# EAGLE design MainPower (EAGLE 9.6.2)
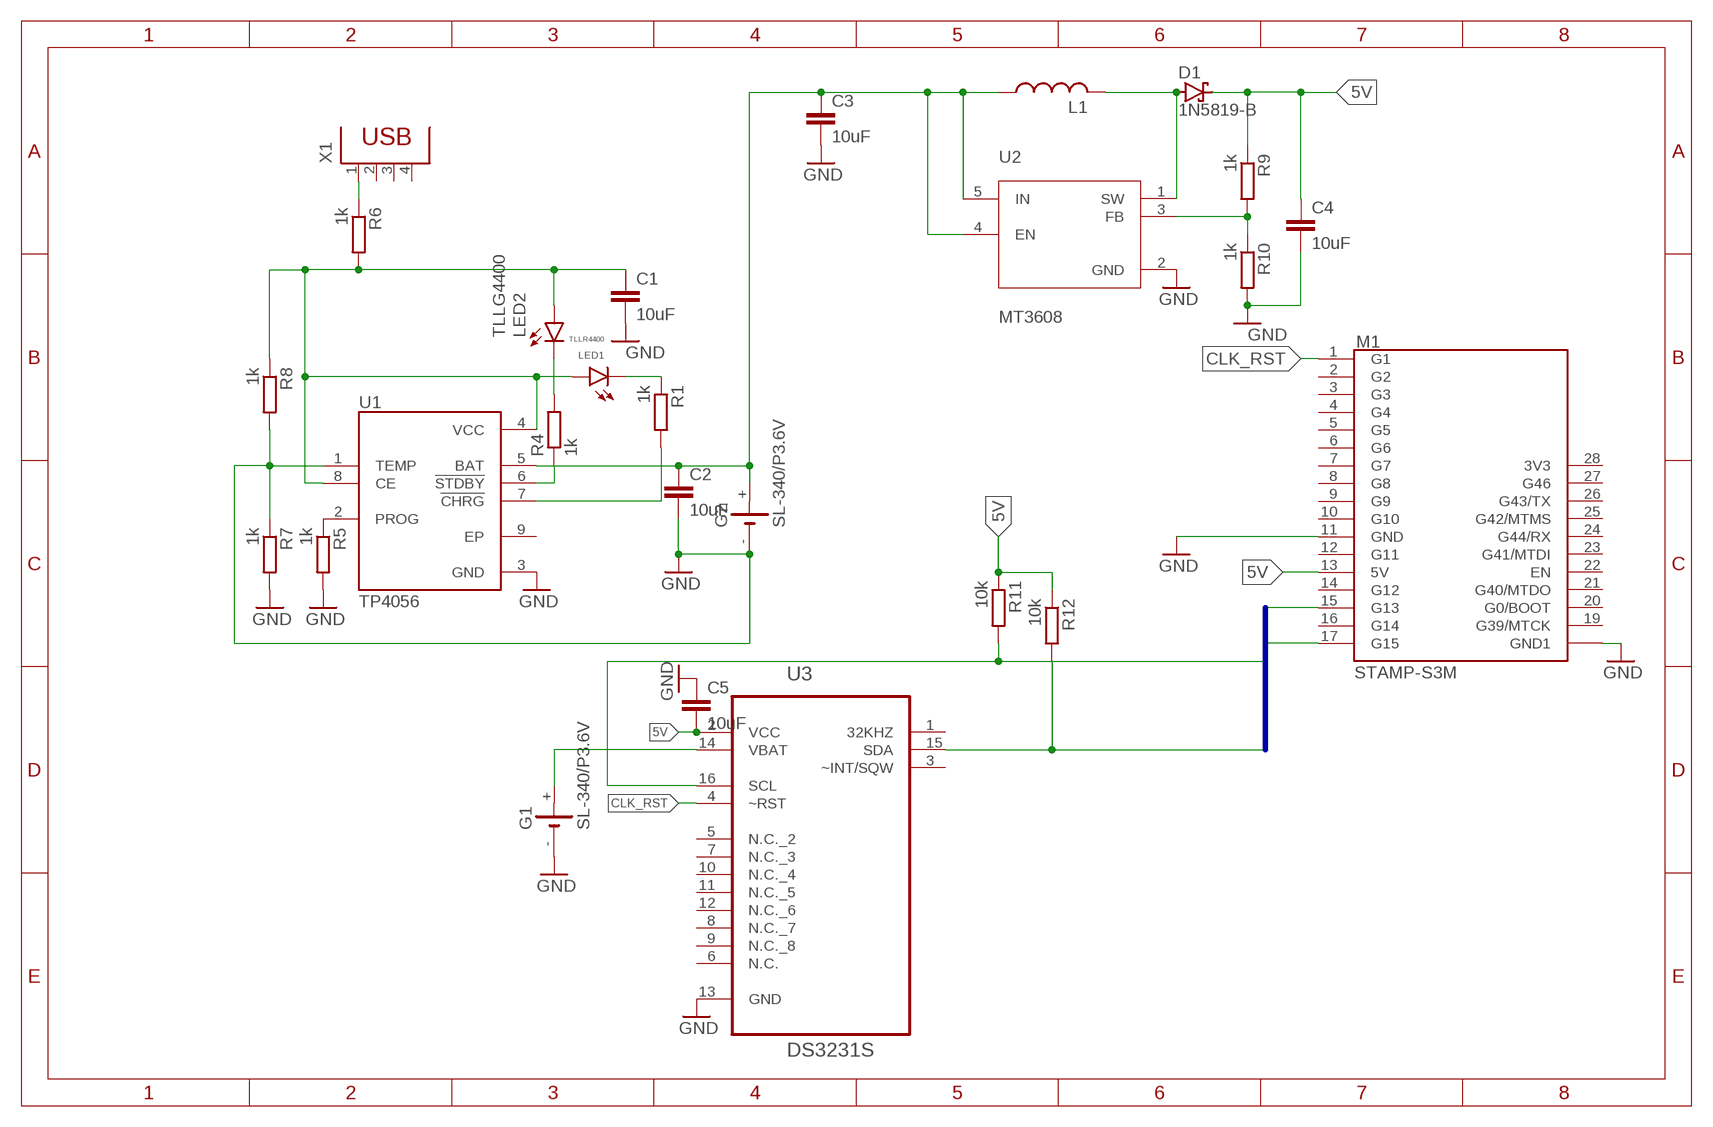
[diagram p0: schematic, sheet 1]

## Parts
C1  10uF  C2,5-3  [C2.5-3]
C2  10uF  C2,5-3  [C2.5-3]
C3  10uF  C2,5-3  [C2.5-3]
C4  10uF  C2,5-3  [C2.5-3]
C5  10uF  C2,5-3  [C2.5-3]
D1  1N5819-B  [DO41-7.6]
G1  SL-340/P3.6V  [SL-340/P3.6V]
G2  SL-340/P3.6V  [SL-340/P3.6V]
L1  L-US0204/7  [0204/7]
LED1  TLLR4400  [LED3MM]
LED2  TLLG4400  [LED3MM]
R1  1k  R-EU_0204/2V  [0204V]
R4  1k  R-EU_0204/2V  [0204V]
R5  1k  R-EU_0204/2V  [0204V]
R6  1k  R-EU_0204/2V  [0204V]
R7  1k  R-EU_0204/2V  [0204V]
R8  1k  R-EU_0204/2V  [0204V]
R9  1k  R-EU_0204/2V  [0204V]
R10  1k  R-EU_0204/2V  [0204V]
R11  10k  R-EU_0204/2V  [0204V]
R12  10k  R-EU_0204/2V  [0204V]
U1  TP4056  [SOP127P600X175-9N]
U2  MT3608  [SOT95P280X145-6N]
U3  DS3231S  [SOIC127P1032X265-16N]
U$2  STAMP-S3M-PIN  [STAMPS3_PIN_FTP]
X1  PN61729  [PN61729]

## Nets
5V: C4.1 C5.2 D1.C R9.1 R11.1 R12.1 U3.2(VCC) U$2.13(5V)
CLK_RST: U3.4(~RST) U$2.1(G1)
GND: C1.2 C2.2 C3.2 C4.2 C5.1 G1.- G2.- R5.2 R7.1 R7.2 R8.2 R10.2 U1.1(TEMP) U1.3(GND) U2.2(GND) U3.13(GND) U$2.11(GND) U$2.18(GND1)
N$2: D1.A L1.2 U2.1(SW)
N$3: R4.1 U1.6(!STDBY)
N$4: G1.+ U3.14(VBAT)
N$5: R5.1 U1.2(PROG)
N$8: LED2.K(C) R4.2
N$9: LED1.K(C) R1.1
N$10: R1.2 U1.7(!CHRG)
N$11: C2.1 C3.1 G2.+ L1.1 U1.5(BAT) U2.4(EN) U2.5(IN)
N$12: R9.2 R10.1 U2.3(FB)
SCL: R11.2 U3.16(SCL) U$2.17(G15)
SDA: R12.2 U3.15(SDA) U$2.15(G13)
USB: C1.1 LED1.A LED2.A R6.1 R6.2 R8.1 U1.4(VCC) U1.8(CE) X1.1
Unconnected: U1.9(EP) U3.1(32KHZ) U3.3(~INT/SQW) U3.5(N.C._2) U3.6(N.C.) U3.7(N.C._3) U3.8(N.C._7) U3.9(N.C._8) U3.10(N.C._4) U3.11(N.C._5) U3.12(N.C._6) U$2.2(G2) U$2.3(G3) U$2.4(G4) U$2.5(G5) U$2.6(G6) U$2.7(G7) U$2.8(G8) U$2.9(G9) U$2.10(G10) U$2.12(G11) U$2.14(G12) U$2.16(G14) U$2.19(G39/MTCK) U$2.20(G0/BOOT) U$2.21(G40/MTDO) U$2.22(EN) U$2.23(G41/MTDI) U$2.24(G44/RX) U$2.25(G42/MTMS) U$2.26(G43/TX) U$2.27(G46) X1.2 X1.3 X1.4

## Buses
SCL,SDA

## Power pins joined to a net without a drawn wire
3V3: U$2.28(3V3)

## Library data of the parts
C1-C5 = capacitor-wima:C: CAPACITOR naming: grid - package width
D1 = diode:1N581*: 1.0A SCHOTTKY BARRIER RECTIFIER Source: http://www.diodes.com/datasheets/ds23001.pdf
G1 G2 = battery:SL-340/P3.6V: LI BATTERY Sonnenschein
L1 = rcl:L-US: INDUCTOR, American symbol; SPICEPREFIX: L
LED1 = led:TLLR4400: Low Current (2mA) LED 3 mm Tinted Diffused Package color RED Source: Data sheet <http://www.farnell.com/datasheets/391100.pdf>; MF: VISHAY SEMICONDUCTOR; OC_FARNELL: 1612437
LED2 = led:TLLG4400: Low Current (2mA) LED 3 mm Tinted Diffused Package color GREEN Source: Data sheet <http://www.farnell.com/datasheets/391098.pdf>; MF: VISHAY SEMICONDUCTOR; OC_FARNELL: 1612435
R1 R4-R12 = rcl:R-EU_: RESISTOR, European symbol; SPICEPREFIX: R
U1 = TP4056:TP4056: Check availability <https://pricing.snapeda.com/parts/TP4056/NanJing%20Top%20Power%20ASIC%20Corp./view-part?ref=eda>; AVAILABILITY: Not in stock; CHECK_PRICES: https://www.snapeda.com/parts/TP4056/NanJing+Top+Power+ASIC+Corp./view-part/?ref=eda; DESCRIPTION: Complete single cell Li-Ion battery with a constant current / constant voltage linear charger; MF: NanJing Top Power ASIC Corp.; MP: TP4056; PACKAGE: Package; PRICE: None; SNAPEDA_LINK: https://www.snapeda.com/parts/TP4056/NanJing+Top+Power+ASIC+Corp./view-part/?ref=snap
U2 = MT3608:MT3608: Check availability <https://pricing.snapeda.com/parts/MT3608/Aerosemi%20Technology%20Co.%2C%20Ltd/view-part?ref=eda>; AVAILABILITY: Not in stock; CHECK_PRICES: https://www.snapeda.com/parts/MT3608/Aerosemi+Technology+Co.%252C+Ltd/view-part/?ref=eda; DESCRIPTION: High Efficiency 1.2MHz 2A Step Up Converter; MF: Aerosemi Technology Co., Ltd; MP: MT3608; PACKAGE: Package; PRICE: None; SNAPEDA_LINK: https://www.snapeda.com/parts/MT3608/Aerosemi+Technology+Co.%252C+Ltd/view-part/?ref=snap
U3 = DS3231S:DS3231S: Check availability <https://pricing.snapeda.com/parts/DS3231S%23/Analog%20Devices/view-part?ref=eda>; AVAILABILITY: In Stock; CHECK_PRICES: https://www.snapeda.com/parts/DS3231S%23/Analog+Devices/view-part/?ref=eda; DESCRIPTION: Extremely Accurate I²C-Integrated RTC/TCXO/Crystal; MF: Analog Devices; MP: DS3231S#; PACKAGE: SOIC-16 Maxim; PRICE: None; SNAPEDA_LINK: https://www.snapeda.com/parts/DS3231S%23/Analog+Devices/view-part/?ref=snap
U$2 = StampS3:STAMP-S3M-PIN
X1 = con-berg:PN61729: BERG USB connector; OC_FARNELL: unknown; OC_NEWARK: unknown

## Board
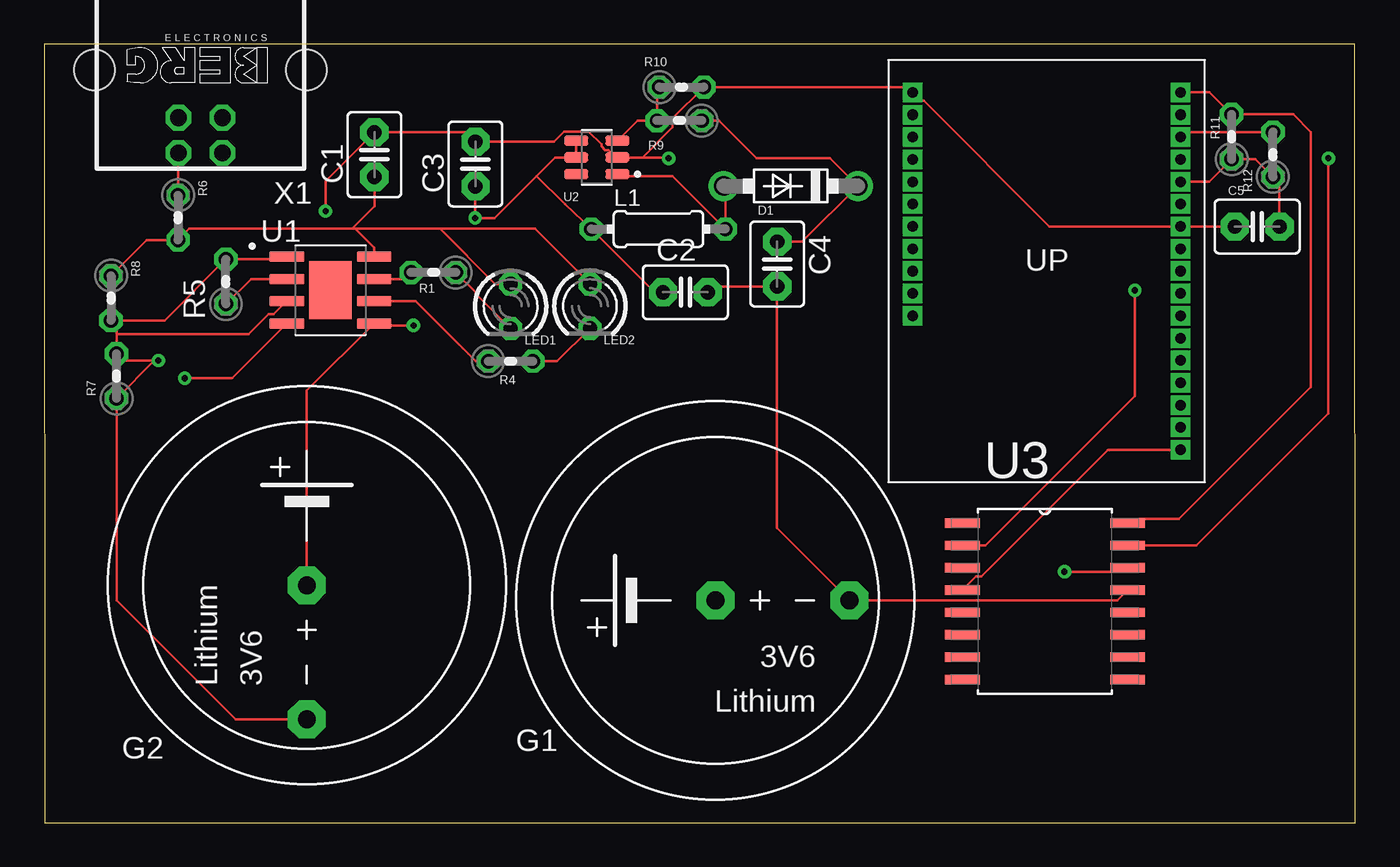
[diagram p1: board, top side]
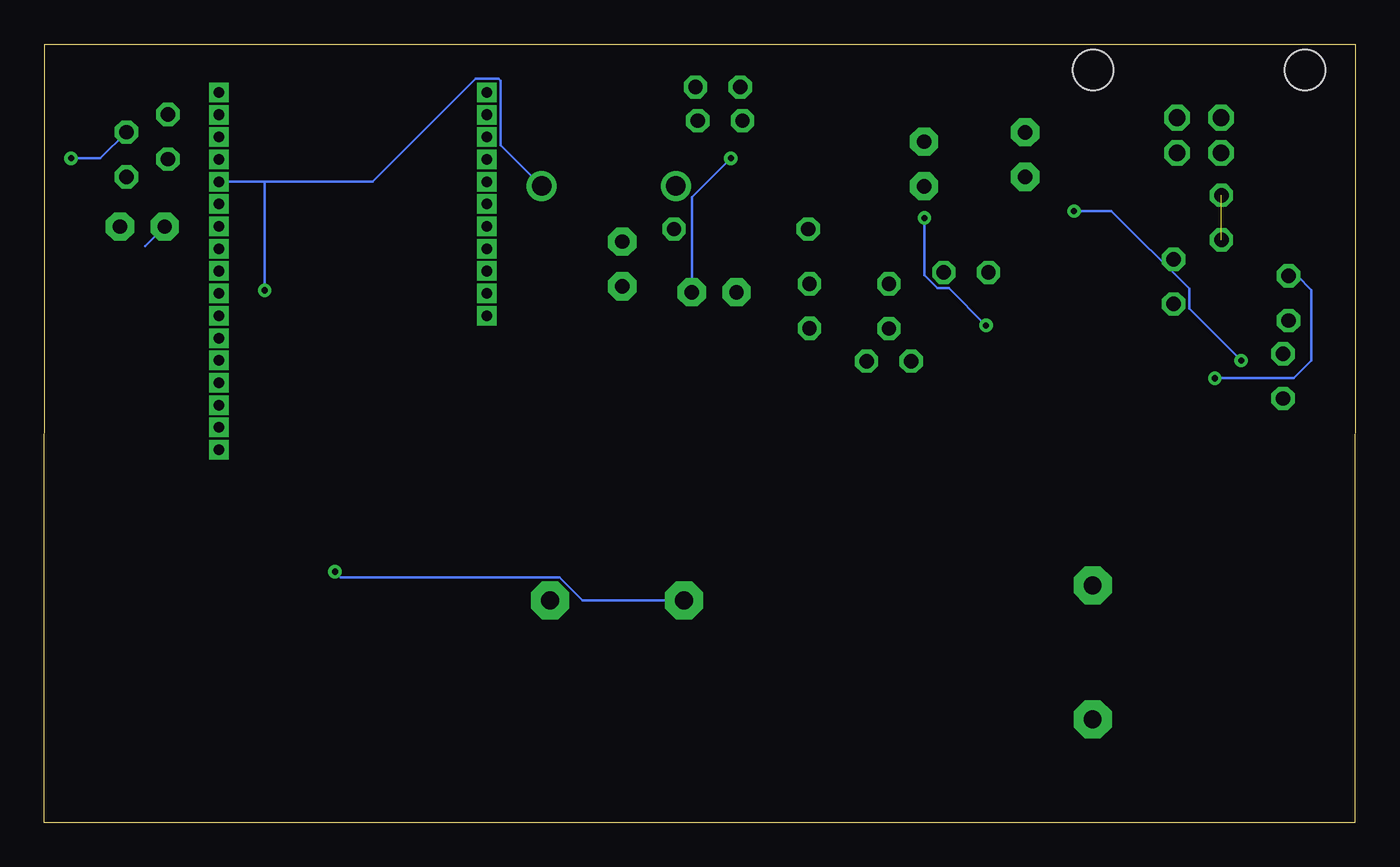
[diagram p2: board, bottom side, seen from below]

Size 74.54 x 44.27 mm. Coordinates in mm from the lower left corner, seen from the top.
Outline: 0.04,0 74.54,0 74.5,44.27 0,44.27 0.04,0
Copper layers (1*16): Top 0.035mm / dielectric 1.5mm / Bottom 0.035mm
Design rules "default": minimum track width 6mil, minimum drill 0.35mm, track to track 6mil, track to pad 6mil, pad to pad 6mil, via to via 6mil, smd to smd 6mil, copper to edge 40mil, drill to drill 6mil, minimum pad ring 10mil, minimum via ring 8mil, stop-mask expansion 4mil, vias tented up to drill 0mil, thermal gap 10mil

### Footprints (pad centres in the part's own frame; a part is rotated, then mirrored left to right if it is on the bottom)
C2.5-3 = drill 0.813 pad 1.6 octagon: 1 -1.27,0; 2 1.27,0
DO41-7.6 = drill 1.1 pad 1.7: A 3.81,0; C -3.81,0
SL-340/P3.6V = drill 1.016 pad 2.159 octagon: + 0,0; - -7.62,0
0204/7 = drill 0.813 octagon: 1 -3.81,0; 2 3.81,0
LED3MM = drill 0.813 octagon: A -1.27,0; K 1.27,0
0204V = drill 0.813 octagon: 1 -1.27,0; 2 1.27,0
SOP127P600X175-9N = smd 1.97 x 0.6: 1 -2.475,1.905; 2 -2.475,0.635; 3 -2.475,-0.635; 4 -2.475,-1.905; 5 2.475,-1.905; 6 2.475,-0.635; 7 2.475,0.635; 8 2.475,1.905 | smd 2.413 x 3.302: 9 0,0
SOT95P280X145-6N = smd 1.37 x 0.59: 1 -1.17,0.95; 2 -1.17,0; 3 -1.17,-0.95; 4 1.17,-0.95; 5 1.17,0; 6 1.17,0.95
SOIC127P1032X265-16N = smd 1.981 x 0.533: 1 -4.699,4.445; 2 -4.699,3.175; 3 -4.699,1.905; 4 -4.699,0.635; 5 -4.699,-0.635; 6 -4.699,-1.905; 7 -4.699,-3.175; 8 -4.699,-4.445; 9 4.699,-4.445; 10 4.699,-3.175; 11 4.699,-1.905; 12 4.699,-0.635; 13 4.699,0.635; 14 4.699,1.905; 15 4.699,3.175; 16 4.699,4.445
STAMPS3_PIN_FTP = drill 0.6 square: 1 -3.81,7.62; 2 -3.81,6.35; 3 -3.81,5.08; 4 -3.81,3.81; 5 -3.81,2.54; 6 -3.81,1.27; 7 -3.81,0; 8 -3.81,-1.27; 9 -3.81,-2.54; 10 -3.81,-3.81; 11 -3.81,-5.08; 12 -3.81,-6.35; 13 -3.81,-7.62; 14 -3.81,-8.89; 15 -3.81,-10.16; 16 -3.81,-11.43; 17 -3.81,-12.7; 18 11.43,-12.7; 19 11.43,-11.43; 20 11.43,-10.16; 21 11.43,-8.89; 22 11.43,-7.62; 23 11.43,-6.35; 24 11.43,-5.08; 25 11.43,-3.81; 26 11.43,-2.54; 27 11.43,-1.27; 28 11.43,0
PN61729 = drill 0.95 octagon: 1 1.25,4.71; 2 -1.25,4.71; 3 -1.25,2.71; 4 1.25,2.71 | hole 2.3: -6.02,0; 6.02,0

### Placement (x,y rotation side)
C1  18.78,37.98 90 top
C2  36.45,30.16 0 top
C3  24.52,37.45 90 top
C4  41.67,31.76 270 top
C5  68.95,33.89 0 top
D1  42.44,36.2 180 top
G1  38.16,12.64 180 top
G2  14.94,13.5 90 top
L1  34.92,33.75 0 top
LED1  26.52,29.36 270 top
LED2  31.03,29.37 270 top
R1  22.13,31.28 180 top
R4  26.52,26.24 0 top
R5  10.34,30.76 90 top
R6  7.62,34.4 270 top
R7  4.12,25.39 90 top
R8  3.81,29.82 270 top
R9  36.11,39.91 180 top
R10  36.24,41.82 0 top
R11  67.5,38.99 90 top
R12  69.85,37.99 90 top
U1  16.28,30.28 0 top
U2  31.42,37.82 180 top
U3  56.89,12.59 0 top
U$2  60.79,28.82 180 top
X1  8.89,42.79 180 top

### Tracks (layer width: path | path; a pad name or v marks a point on that pad's centre or on a via)
5V  (via drill 0.35)
  Top 0.152: R9.1 38.36,39.91 40.5,37.77 44.68,37.77 D1.C 43.08,33.03 C4.1 | U$2.13 66.22,36.44 R11.1 68.85,37.72 R12.1 70.22,36.35 C5.2 70.22,33.79 | 51.51,15.77 U3.2 53.5,15.77 62,24.27 v62,30.27
  Bottom 0.152: D1.C 48.58,38.53 48.58,42.17 48.71,42.3 50.01,42.3 55.87,36.44 62,36.44 | 62,36.44 U$2.13 | v62,30.27 62,36.44
CLK_RST
  Top 0.152: U3.4 52.97,14 53.28,14 60.48,21.2 U$2.1
GND  (via drill 0.35)
  Top 0.152: 67.68,33.91 C5.1 U$2.11 57.14,33.9 50.01,41.03 49.85,41.03 U$2.18 49.06,41.82 R10.2 35.73,40.04 35.73,39.54 34.01,37.82 | 32.32,37.82 32.5,37.82 | 32.5,37.82 U2.2 34.01,37.82 | 4.12,27.77 4.12,28.24 R8.2 6.86,28.55 R5.2 13.65,32.03 U1.1 | 4.12,27.77 R7.2 4.51,26.27 v6.5,26.27 6.27,26.27 R7.1 4.12,12.65 10.89,5.88 G2.- | U1.3 13.06,28.9 12.77,28.9 11.64,27.77 4.12,27.77 | 18.9,39.37 C1.2 | v16,34.77 16,36.47 C1.2 | C1.2 23.99,39.25 C3.2 28.98,38.72 29.56,39.29 30.94,39.29 31.68,38.56 31.68,38.47 31.9,38.25 32.07,38.25 32.5,37.82 | C2.2 38.05,30.49 C4.2 41.67,16.75 G1.- 61,12.64 U3.13 | 34.01,37.82 35.45,37.82 v35.5,37.77
  Bottom 0.152: v6.5,26.27 9.45,29.22 9.45,30.36 13.86,34.77 v16,34.77 | v35.5,37.77 37.72,35.55 C2.2 | C5.1 68.8,32.77
N$2
  Top 0.152: U2.1 32.69,36.77 35.71,36.77 L1.2 38.73,36.1 D1.A
N$3
  Top 0.152: R4.1 24.53,26.24 21.12,29.65 U1.6
N$4  (via drill 0.35)
  Top 0.152: v58,14.27 61.36,14.27 U3.14
  Bottom 0.152: G1.+ 43.93,12.64 45.24,13.95 57.68,13.95 v58,14.27
N$5
  Top 0.152: 13.61,31.11 U1.2 11.77,30.91 R5.1
N$8
  Top 0.152: LED2.K 29.17,26.24 R4.2
N$9
  Top 0.152: LED1.K 24.52,30.09 24.52,30.16 R1.1
N$10
  Top 0.152: R1.2 20.5,30.91 U1.7
N$11  (via drill 0.35)
  Top 0.152: G2.+ 14.94,24.56 U1.5 18.86,28.27 v21,28.27 | C3.1 24.5,36.16 v24.5,34.38 25.61,34.38 28,36.77 | 28,36.77 29.05,37.82 U2.5 U2.4 | 28,36.77 29.61,35.16 L1.1 34.7,30.16 C2.1
  Bottom 0.152: v21,28.27 23.12,30.39 23.77,30.39 24.5,31.12 v24.5,34.38
N$12
  Top 0.152: U2.3 33.73,39.91 R9.2 34.84,41.69 R10.1
SCL
  Top 0.152: R11.2 | R11.2 66.24,41.52 U$2.17 | U3.16 61.82,17.27 64.5,17.27 72,24.77 72,39.27 71,40.27 R11.2
SDA  (via drill 0.35)
  Top 0.152: R12.2 64.88,39.26 U$2.15 | U3.15 65.5,15.77 73,23.27 v73,37.77
  Bottom 0.152: v73,37.77 71.34,37.77 R12.2
USB  (via drill 0.35)  (1 unrouted)
  Top 0.152: X1.1 7.62,38.06 R6.1 | R8.1 5.85,33.13 R6.2 8.26,33.77 17.5,33.77 | 17.5,33.77 17.67,33.77 | 22.5,33.77 25.64,30.63 LED1.A | 22.5,33.77 27.9,33.77 LED2.A | 22.5,33.77 17.67,33.77 | U1.4 10.7,25.27 v8,25.27 | U1.8 18.75,32.69 17.67,33.77 | 17.5,33.77 18.78,35.05 C1.1
  Bottom 0.152: v8,25.27 3.5,25.27 2.5,26.27 2.5,30.27 3.32,31.09 R8.1